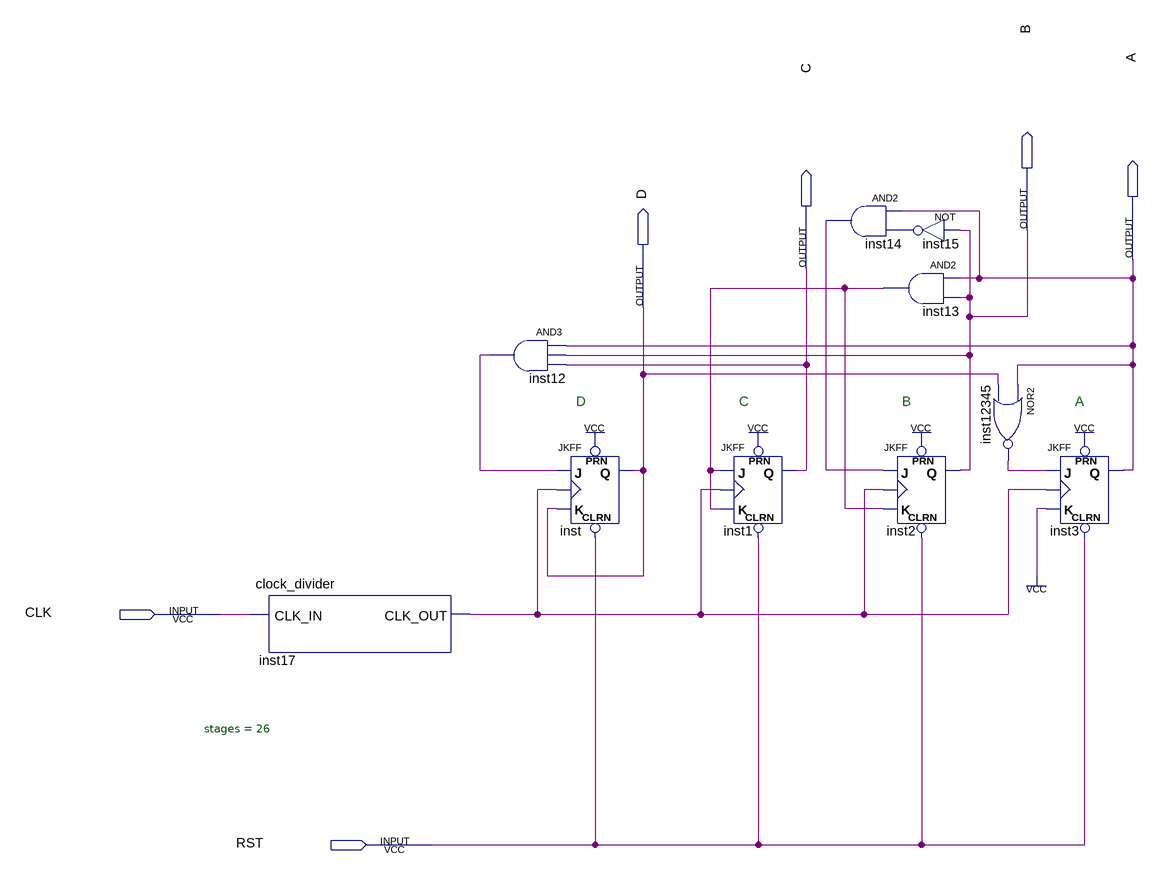
[diagram p0: schematic sheet]
// Quartus schematic mod9Counter_DE0.bdf as structural Verilog: 10 symbols, 6 pins
module mod9Counter_DE0 (
  input  CLK,
  input  RST,
  output B,
  output A,
  output C,
  output D
);

  wire inst12_out, inst13_out, inst14_out, inst15_out, inst17_clk_out, inst12345_out;

  clock_divider #(.stages(26)) inst17 (.CLK_IN(CLK), .CLK_OUT(inst17_clk_out));
  and inst12 (inst12_out, A, B, C);
  JKFF inst (.PRN(1'b1), .CLRN(RST), .K(D), .J(inst12_out), .CLK(inst17_clk_out), .Q(D));
  JKFF inst1 (.PRN(1'b1), .CLRN(RST), .K(inst13_out), .J(inst13_out), .CLK(inst17_clk_out), .Q(C));
  and inst14 (inst14_out, A, inst15_out);
  not inst15 (inst15_out, B);
  and inst13 (inst13_out, A, B);
  JKFF inst2 (.PRN(1'b1), .CLRN(RST), .K(inst13_out), .J(inst14_out), .CLK(inst17_clk_out), .Q(B));
  nor inst12345 (inst12345_out, A, D);
  JKFF inst3 (.PRN(1'b1), .CLRN(RST), .K(1'b1), .J(inst12345_out), .CLK(inst17_clk_out), .Q(A));

  // Notes on the sheet:
  //   D
  //   C
  //   B
  //   A
endmodule
